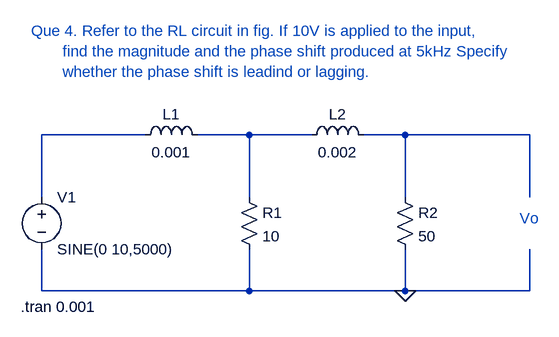
[diagram p0: schematic 4_Dheerendra_23EE019_AC_Transient.asc]
4_Dheerendra_23EE019_AC_Transient.asc, the LTspice schematic file:
Version 4
SHEET 1 880 680
WIRE -608 192 -768 192
WIRE -448 192 -528 192
WIRE -352 192 -448 192
WIRE -208 192 -272 192
WIRE -16 192 -208 192
WIRE -768 288 -768 192
WIRE -448 288 -448 192
WIRE -208 288 -208 192
WIRE -16 288 -16 192
WIRE -768 432 -768 368
WIRE -448 432 -448 368
WIRE -448 432 -768 432
WIRE -208 432 -208 368
WIRE -208 432 -448 432
WIRE -16 432 -16 368
WIRE -16 432 -208 432
FLAG -208 432 0
SYMBOL voltage -768 272 R0
WINDOW 123 0 0 Left 0
WINDOW 39 0 0 Left 0
SYMATTR InstName V1
SYMATTR Value SINE(0 10,5000)
SYMBOL ind -624 208 R270
WINDOW 0 32 56 VTop 2
WINDOW 3 5 56 VBottom 2
SYMATTR InstName L1
SYMATTR Value 0.001
SYMBOL ind -368 208 R270
WINDOW 0 32 56 VTop 2
WINDOW 3 5 56 VBottom 2
SYMATTR InstName L2
SYMATTR Value 0.002
SYMBOL res -464 272 R0
SYMATTR InstName R1
SYMATTR Value 10
SYMBOL res -224 272 R0
SYMATTR InstName R2
SYMATTR Value 50
TEXT -784 32 Left 2 ;Que 4. Refer to the RL circuit in fig. If 10V is applied to the input,\n       find the magnitude and the phase shift produced at 5kHz Specify\n       whether the phase shift is leadind or lagging.
TEXT -32 320 Left 2 ;Vo
TEXT -800 456 Left 2 !.tran 0.001

The netlist it stands for:
* 4_Dheerendra_23EE019_AC_Transient.asc
V1 N001 0 SINE(0 10,5000)
L1 N001 N002 0.001
L2 N002 N003 0.002
R1 N002 0 10
R2 N003 0 50
* Que 4. Refer to the RL circuit in fig. If 10V is applied to the input,
*        find the magnitude and the phase shift produced at 5kHz Specify
*        whether the phase shift is leadind or lagging.
* Vo
.tran 0.001
.backanno
.end